# Altium schematic sheet LED_Blue_Direct_BRIGHT.SchDoc
size A4; SheetNumber: 6; SheetTotal: 29
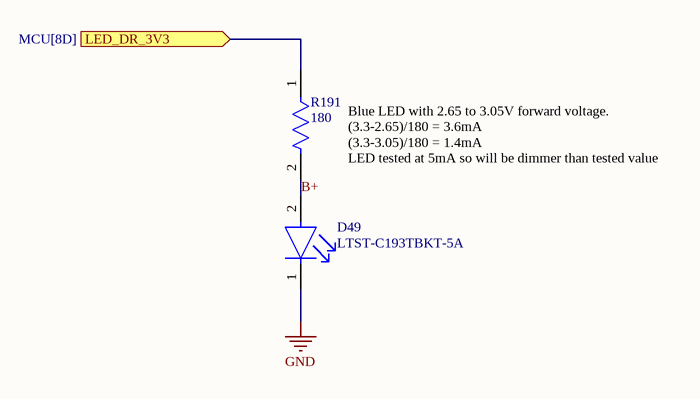
[diagram p0: LED_Blue_Direct_BRIGHT.SchDoc]

## Parts
D49  LTST-C193TBKT-5A  [FP-LTST-C193TBKT-5A-MFG]
R191  value 180  [FP-RT0603-IPC_C]  (hidden comment: RT0603DRE07180RL)

## Ports
LED_DR_3V3 (in, see MCU[8D])

## Nets
GND: D49.1(C)
B+: D49.2(A) R191.2
LED_DR_3V3: R191.1 ; port LED_DR_3V3

## Notes on the sheet
- Blue LED with 2.65 to 3.05V forward voltage.
  (3.3-2.65)/180 = 3.6mA
  (3.3-3.05)/180 = 1.4mA
  LED tested at 5mA so will be dimmer than tested value

## Library data of the parts
D49 = CMP-007-00045-1: LED blue 0603 wavelength 465~475nm light intensity 15mcd Front Mounting; Forward Current: 20mA; Viewing Angle: 130°; Lens Color: Clear, Colorless; Peak Wavelength: 468nm; Forward Voltage: 2.8V; Number of Elements: 1; Lens Style: Clear, Colorless, Diffused, Rectangular; Shape: Rectangular; Dominant Wavelength: 475nm; Test Current: 5mA; Wavelength: 470nm; Lens Transparency: Clear; Reverse Voltage: 5V; Power Dissipation: 76mW; Mounting Technology: Surface Mount; Lifecycle Status: Production; Pins: 2; Schedule B: 8541402000, 8541402000; RoHS: Compliant; REACH SVHC: Yes; Number of LEDs: 1; Width: 800µm; Luminous Intensity: 15mcd; Radiation Hardening: No; Case Code (Imperial): 0603; Length: 1.6mm; Case Code (Metric): 1608; Terminal Pitch: 1.5mm; Lead Free: Lead Free; Min Operating Temperature: -20°C; Color: Blue; Case/Package: 0603; Number of Terminals: 2; China RoHS: Compliant; Max Operating Temperature: 80°C; Contact Plating: Tin; Height: 350µm; Number of Circuits: 1; Illumination Color: Blue; Depth: 800µm
R191 = CMP-009-00324-1: Res Thin Film 0603 180 Ohm 0.5% 0.1W(1/10W) ±50ppm/C Pad SMD T/R; Power Rating: 100mW; Voltage Rating (DC): 50V; Voltage Rating: 75V; Temperature Coefficient: 50ppm/°C; Composition: Thin Film; Case/Package: 0603; Mounting Technology: Surface Mount; Harmonized Tariff Schedule (HTS) Code: 8533.21.00.30; REACH SVHC: Yes; Max Operating Temperature: 155°C; Tolerance: 0.5%; Min Operating Temperature: -55°C; Height: 450µm; RoHS: Compliant; Working Voltage: 75V; Number of Terminals: 2; China RoHS: Non-Compliant; Export Control Classification Number (ECCN) Code: EAR99; Introduction Date: 2008-07-11; Packaging: Tape & Reel (TR); Lifecycle Status: Production; Schedule B: 8533210045; Width: 800µm; Length: 1.6mm; Case Code (Imperial): 0603; Country of Origin: Mainland China, Taiwan; Features: Moisture Resistant; Lead Free: Lead Free; Max Power Dissipation: 100mW; Number of Terminations: 2